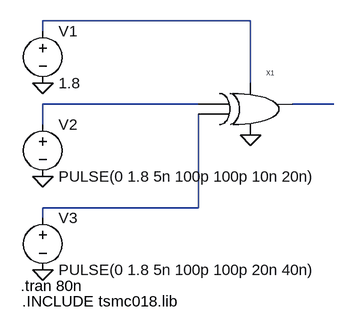
[diagram p0: schematic half_adder.asc]
half_adder.asc, the LTspice schematic file:
Version 4
SHEET 1 880 680
WIRE 240 0 -80 0
WIRE -80 16 -80 0
WIRE 240 96 240 0
WIRE 160 128 -80 128
WIRE 368 128 304 128
WIRE -80 160 -80 128
WIRE 160 288 160 144
WIRE 160 288 -80 288
WIRE -80 304 -80 288
FLAG 240 176 0
FLAG -80 96 0
FLAG -80 240 0
FLAG -80 384 0
SYMBOL voltage -80 0 R0
WINDOW 123 0 0 Left 0
WINDOW 39 0 0 Left 0
SYMATTR InstName V1
SYMATTR Value 1.8
SYMBOL voltage -80 144 R0
WINDOW 123 0 0 Left 0
WINDOW 39 0 0 Left 0
SYMATTR InstName V2
SYMATTR Value PULSE(0 1.8 5n 100p 100p 10n 20n)
SYMBOL voltage -80 288 R0
WINDOW 123 0 0 Left 0
WINDOW 39 0 0 Left 0
SYMATTR InstName V3
SYMATTR Value PULSE(0 1.8 5n 100p 100p 20n 40n)
SYMBOL xor 288 144 R0
SYMATTR InstName X1
TEXT -114 408 Left 2 !.tran 80n
TEXT -112 432 Left 2 !.INCLUDE tsmc018.lib

The netlist it stands for:
* half_adder.asc
V1 N001 0 1.8
V2 N002 0 PULSE(0 1.8 5n 100p 100p 10n 20n)
V3 N004 0 PULSE(0 1.8 5n 100p 100p 20n 40n)
XX1 N002 N004 N001 0 N003 xor  ; pins A B vdd vss Vout
.tran 80n
.INCLUDE tsmc018.lib
.backanno
.end